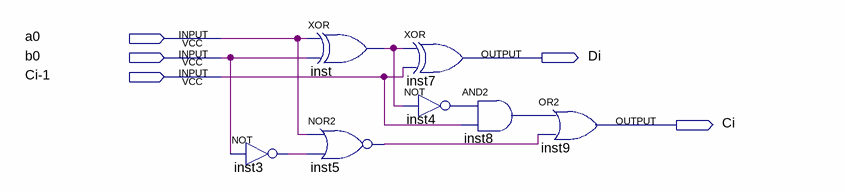
[diagram p0: schematic sheet]
// Quartus schematic SB.bdf as structural Verilog: 7 symbols, 5 pins
module SB (
  input  a0,
  input  b0,
  input  \Ci-1 ,
  output Di,
  output Ci
);

  wire inst3_out, inst4_out, inst5_out, inst8_out, inst_out;

  not inst3 (inst3_out, b0);
  xor inst (inst_out, a0, b0);
  nor inst5 (inst5_out, a0, inst3_out);
  xor inst7 (Di, inst_out, \Ci-1 );
  not inst4 (inst4_out, inst_out);
  and inst8 (inst8_out, inst4_out, \Ci-1 );
  or inst9 (Ci, inst8_out, inst5_out);
endmodule
